# EAGLE design eNode2 (EAGLE 7.2.0)
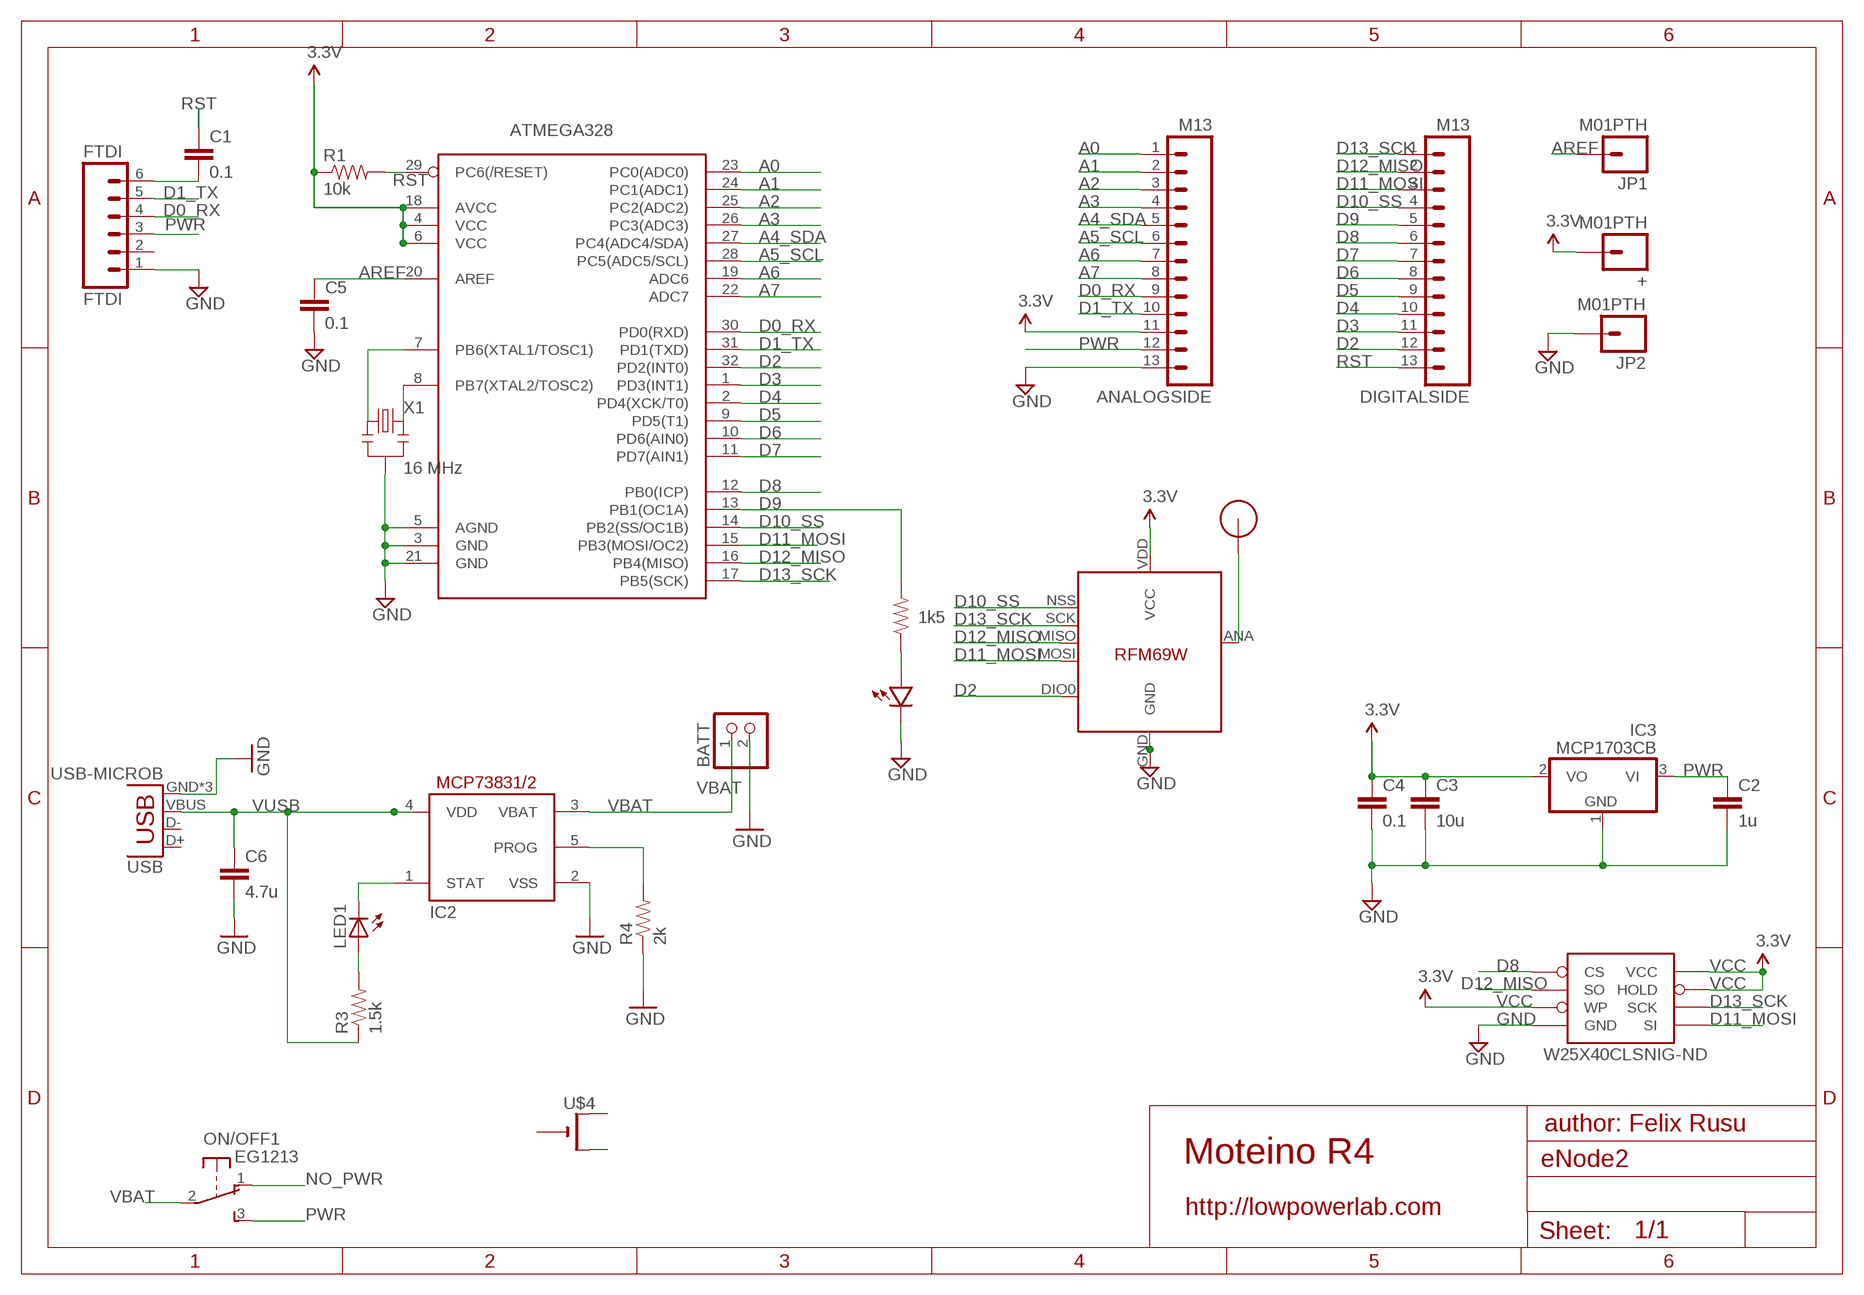
[diagram p0: schematic, sheet 1]

## Parts
+  M01PTH  [1X01]
ANALOGSIDE  M13  [1X13]
ATMEGA328  ATMega-328  ATMEGA168/328TQFP32  [TQFP32-08]
BATT  PINHD-1X2  [1X02]
C1  0.1  CAP0603-CAP  [0603-CAP]
C2  1u  CAP0603-CAP  [0603-CAP]
C3  10u  CAP0805-CAP  [0805-CAP]
C4  0.1  CAP0603-CAP  [0603-CAP]
C5  0.1  CAP0603-CAP  [0603-CAP]
C6  4.7u  CAP0603-CAP  [0603-CAP]
DIGITALSIDE  M13  [1X13]
FTDI  FTDI  M06SIP  [1X06]
IC2  MCP73831/OT  [SOT23-5L]
IC3  MCP1703CB  [SOT23]
JP1  M01PTH  [1X01]
JP2  M01PTH  [1X01]
LED1  LEDCHIPLED_0603  [CHIPLED_0603]
ON/OFF  EG1213  [EG1213]
R1  10k  RESISTOR0603-RES  [0603-RES]
R2  1k5  RESISTOR0603-RES  [0603-RES]
R3  1.5k  RESISTOR0603-RES  [0603-RES]
R4  2k  RESISTOR0603-RES  [0603-RES]
U$1  RFM12B_ANTENNA  [RFM12B-ANTENNA]
U$2  LED0603  [0603-LED]
U$4  CR2032THM  [CR2032-THRU]
U$5  RFM69  [RFM69W-MINPADS]
USB  USB-MICROB  [USB-MICROB]
W25X40CLSNIG-ND  AT25F512BWIDE_5.3MM  [SO08WIDE]
X1  16 MHz  RESONATORSMD  [RESONATOR-SMD]

## Nets
A0: ANALOGSIDE.1 ATMEGA328.23(PC0(ADC0))
A1: ANALOGSIDE.2 ATMEGA328.24(PC1(ADC1))
A2: ANALOGSIDE.3 ATMEGA328.25(PC2(ADC2))
A3: ANALOGSIDE.4 ATMEGA328.26(PC3(ADC3))
A4_SDA: ANALOGSIDE.5 ATMEGA328.27(PC4(ADC4/SDA))
A5_SCL: ANALOGSIDE.6 ATMEGA328.28(PC5(ADC5/SCL))
A6: ANALOGSIDE.7 ATMEGA328.19(ADC6)
A7: ANALOGSIDE.8 ATMEGA328.22(ADC7)
AREF: ATMEGA328.20(AREF) C5.1 JP1.1
D0_RX: ANALOGSIDE.9 ATMEGA328.30(PD0(RXD)) FTDI.4
D1_TX: ANALOGSIDE.10 ATMEGA328.31(PD1(TXD)) FTDI.5
D2: ATMEGA328.32(PD2(INT0)) DIGITALSIDE.12 U$5.DIO0
D3: ATMEGA328.1(PD3(INT1)) DIGITALSIDE.11
D4: ATMEGA328.2(PD4(XCK/T0)) DIGITALSIDE.10
D5: ATMEGA328.9(PD5(T1)) DIGITALSIDE.9
D6: ATMEGA328.10(PD6(AIN0)) DIGITALSIDE.8
D7: ATMEGA328.11(PD7(AIN1)) DIGITALSIDE.7
D8: ATMEGA328.12(PB0(ICP)) DIGITALSIDE.6 W25X40CLSNIG-ND.1(CS)
D9: ATMEGA328.13(PB1(OC1A)) DIGITALSIDE.5 R2.2
D10_SS: ATMEGA328.14(PB2(SS/OC1B)) DIGITALSIDE.4 U$5.NSS(SEL)
D11_MOSI: ATMEGA328.15(PB3(MOSI/OC2)) DIGITALSIDE.3 U$5.MOSI W25X40CLSNIG-ND.5(SI)
D12_MISO: ATMEGA328.16(PB4(MISO)) DIGITALSIDE.2 U$5.MISO W25X40CLSNIG-ND.2(SO)
D13_SCK: ATMEGA328.17(PB5(SCK)) DIGITALSIDE.1 U$5.SCK W25X40CLSNIG-ND.6(SCK)
GND [power]: ANALOGSIDE.13 ATMEGA328.3(GND) ATMEGA328.5(AGND) ATMEGA328.21(GND) BATT.2 C2.2 C3.2 C4.2 C5.2 C6.2 FTDI.1 IC2.2(VSS) IC3.1(GND) JP2.1 R4.1 U$2.MINUS U$5.GND USB.GND USB.MT1(GND) USB.MT2(GND) W25X40CLSNIG-ND.4(GND) X1.2
N$1: ATMEGA328.7(PB6(XTAL1/TOSC1)) X1.1
N$2: R2.1 U$2.PLUS
N$3: U$1.P$1 U$5.ANA(ANT)
N$4: LED1.A R3.2
N$20: C1.2 FTDI.6
N$21: ATMEGA328.8(PB7(XTAL2/TOSC2)) X1.3
NO_PWR: ON/OFF.1(1:O)
PROG: IC2.5(PROG) R4.2
PWR [power]: ANALOGSIDE.12 C2.1 FTDI.3 IC3.3(VI) ON/OFF.3(1:S)
RST: ATMEGA328.29(PC6(/RESET)) C1.1 DIGITALSIDE.13 R1.2
STAT: IC2.1(STAT) LED1.C
VBAT: BATT.1 IC2.3(VBAT) ON/OFF.2(1:P)
VCC: +.1 ANALOGSIDE.11 ATMEGA328.4(VCC) ATMEGA328.6(VCC) ATMEGA328.18(AVCC) C3.1 C4.1 IC3.2(VO) R1.1 U$5.VDD(VCC) W25X40CLSNIG-ND.3(WP) W25X40CLSNIG-ND.7(HOLD) W25X40CLSNIG-ND.8(VCC) ; supply symbol labelled 3.3V
VUSB: C6.1 IC2.4(VDD) R3.1 USB.VBUS
Unconnected: FTDI.2 ON/OFF.MT1(MT) ON/OFF.MT2(MT) U$4.+1(+) U$4.+2(+1) U$4.- USB.D+ USB.D-

## Notes on the sheet
- author: Felix Rusu
- Moteino R4
- http://lowpowerlab.com

## Library data of the parts
+ JP1 JP2 = SparkFun-Connectors:M01: Header 1 Standard 1-pin 0.1" header. Use with straight break away headers (SKU : PRT-00116), right angle break away headers (PRT-00553), swiss pins (PRT-00743), machine pins (PRT-00117), and female headers (PRT-00115).
ANALOGSIDE DIGITALSIDE = SparkFun-Connectors:M13: 13-pin single row .1" header
ATMEGA328 = LowPowerLab:ATMEGA168/328: Atmel 32-pin 8-bit micro, 16k flash.
BATT = pinhead:PINHD-1X2: PIN HEADER
C1-C5 = LowPowerLab:CAP: Capacitor Standard 0603 ceramic capacitor, and 0.1" leaded capacitor.
C6 = SparkFun-Passives:CAP: Capacitor Standard 0603 ceramic capacitor, and 0.1" leaded capacitor.
FTDI = SparkFun-Connectors:M06: Header 6 Standard 6-pin 0.1" header. Use with straight break away headers (SKU : PRT-00116), right angle break away headers (PRT-00553), swiss pins (PRT-00743), machine pins (PRT-00117), and female headers (PRT-00115). Molex polarized connector foot print use with SKU : PRT-08094 with associated crimp pins and housings. NOTES ON THE VARIANTS LOCK and LOCK_LONGPADS... This footprint was designed to help hold the alignment of a through-hole component (i.e. 6-pin header) while soldering it into place. You may notice that each hole has been shifted either up or down by 0.005 of an inch from it's more standard position (which is a perfectly straight line). This slight alteration caused the pins (the squares in the middle) to touch the edges of the holes. Because they are alternating, it causes a "brace" to hold the component in place. 0.005 has proven to be the perfect amount of "off-center" position when using our standard breakaway headers. Although looks a little odd when you look at the bare footprint, once you have a header in there, the alteration is very hard to notice. Also, if you push a header all the way into place, it is covered up entirely on the bottom side. This idea of altering the position of holes to aid alignment will be further integrated into the Sparkfun Library for other footprints. It can help hold any component with 3 or more connection pins.
IC2 = adafruit:MCP73831: MCP73831/2 Miniature Single-Cell, Fully Integrated Li-Ion, Li-Polymer Charge Management Controllers. Nice and small simple lipoly charge controller, with adjustable current and status output (LED) http://www.ladyada.net/library/pcb/eaglelibrary.html
IC3 = linear:MCP1703: 250 mA, 16V, Low Quiescent Current LDO Regulator Source: http://ww1.microchip.com/downloads/en/DeviceDoc/22049b.pdf
LED1 = adafruit:LED: LED OSRAM: - CHIPLED LG R971, LG N971, LY N971, LG Q971, LY Q971, LO R971, LY R971 LH N974, LH R974 LS Q976, LO Q976, LY Q976 LO Q996 - Hyper CHIPLED LW Q18S LB Q993, LB Q99A, LB R99A - SideLED LS A670, LO A670, LY A670, LG A670, LP A670 LB A673, LV A673, LT A673, LW A673 LH A674 LY A675 LS A676, LA A676, LO A676, LY A676, LW A676 LS A679, LY A679, LG A679 - Hyper Micro SIDELED® LS Y876, LA Y876, LO Y876, LY Y876 LT Y87S - SmartLED LW L88C, LW L88S LB L89C, LB L89S, LG L890 LS L89K, LO L89K, LY L89K LS L896, LA L896, LO L896, LY L896 - TOPLED LS T670, LO T670, LY T670, LG T670, LP T670 LSG T670, LSP T670, LSY T670, LOP T670, LYG T670 LG T671, LOG T671, LSG T671 LB T673, LV T673, LT T673, LW T673 LH T674 LS T676, LA T676, LO T676, LY T676, LB T676, LH T676, LSB T676, LW T676 LB T67C, LV T67C, LT T67C, LS T67K, LO T67K, LY T67K, LW E67C LS E67B, LA E67B, LO E67B, LY E67B, LB E67C, LV E67C, LT E67C LW T67C LS T679, LY T679, LG T679 LS T770, LO T770, LY T770, LG T770, LP T770 LB T773, LV T773, LT T773, LW T773 LH T774 LS E675, LA E675, LY E675, LS T675 LS T776, LA T776, LO T776, LY T776, LB T776 LHGB T686 LT T68C, LB T68C - Hyper Mini TOPLED® LB M676 - Mini TOPLED Santana® LG M470 LS M47K, LO M47K, LY M47K Source: http://www.osram.convergy.de/
ON/OFF = adafruit:EG1213: E-Switch right-angle slide SPDT Part #EG1213 http://www.ladyada.net/library/eagle
R1 R2 = LowPowerLab:RESISTOR: Resistor Basic schematic elements and footprints for 0603, 1206, and PTH resistors.
R3 R4 = SparkFun-Passives:RESISTOR: Resistor Basic schematic elements and footprints for 0603, 1206, and PTH resistors.
U$1 = LowPowerLab:RFM12B_ANTENNA
U$2 = LowPowerLab:LED
U$4 = adafruit:CR2032
U$5 = LowPowerLab:RFM69
USB = SparkFun-Connectors:USB: USB Connectors USB-B-PTH is fully proven SKU : PRT-00139/CONN-08278 USB-miniB is fully proven SKU : PRT-00587 USB-A-PCB is untested. USB-A-H is throughly reviewed, but untested. Spark Fun Electronics SKU : PRT-00437 USB-B-SMT is throughly reviewed, but untested. Needs silkscreen touching up. USB-A-S has not been used/tested USB-MB-H has not been used/tested USB-MICROB has been used. CONN-09505; PROD_ID: CONN-09505
W25X40CLSNIG-ND = LowPowerLab:AT25F512B: 4-Mbit SPI flash memory
X1 = SparkFun:RESONATOR: Resonator Small SMD resonator. This is the itty bitty 10/20MHz resonators with built in caps. CSTCE10M0G55 and CSTCE20M0V53. Footprint has been reviewed closely but hasn't been tested yet.

## Net classes
1 power: width 0.381 mm, clearance 0.254 mm

## Board
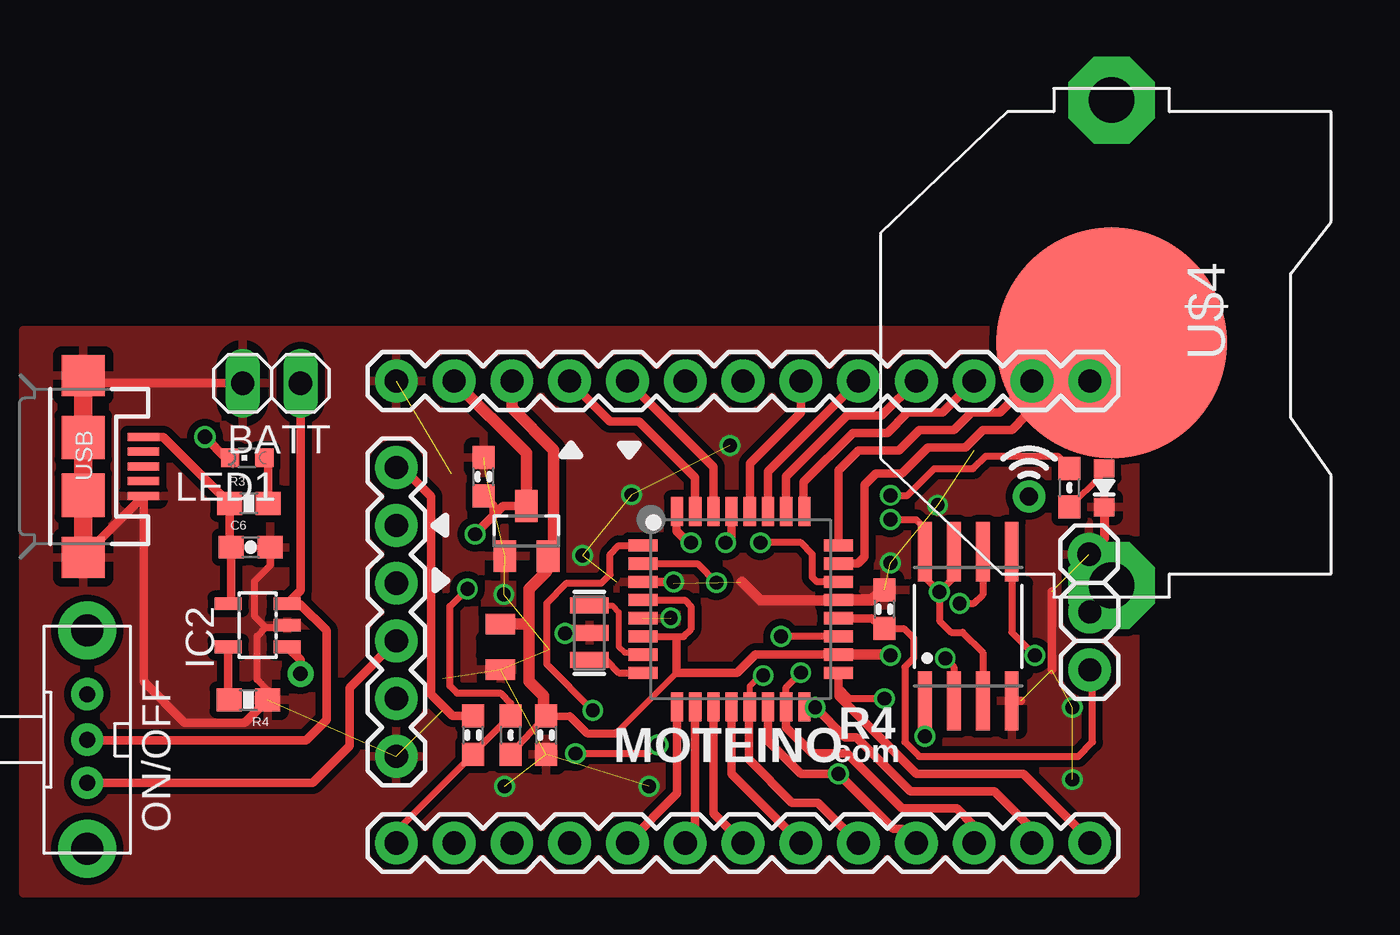
[diagram p1: board, top side]
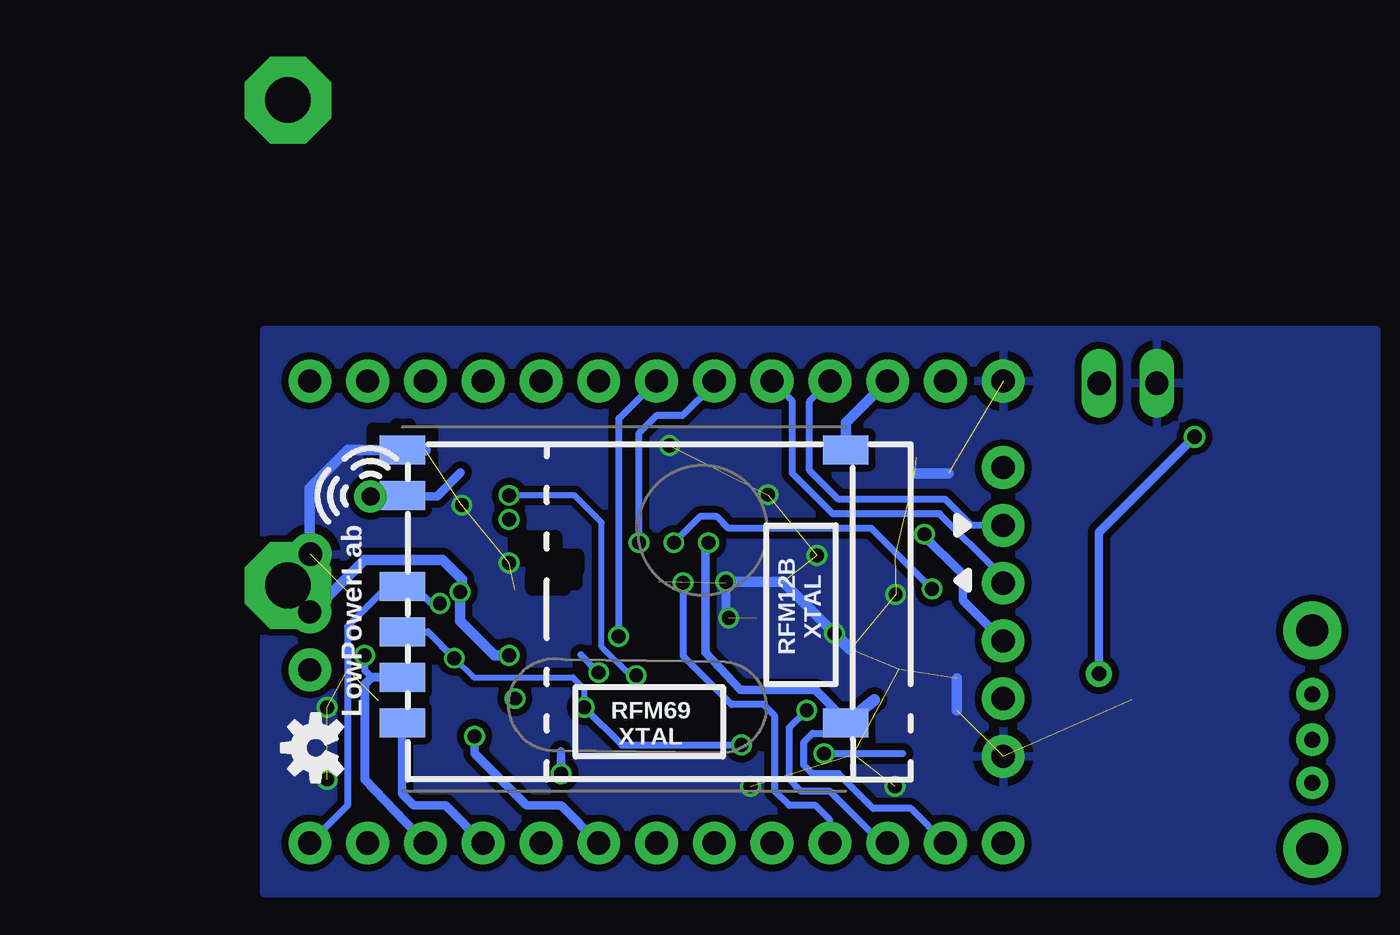
[diagram p2: board, bottom side, seen from below]

No outline drawn. Coordinates in mm, seen from the top.
Copper layers (1*16): Top 0.035mm / dielectric 1.5mm / Bottom 0.035mm
Design rules "ITEADstudio_DRC *": minimum track width 10mil, minimum drill 12mil, track to track 10mil, track to pad 10mil, pad to pad 10mil, via to via 10mil, smd to smd 0mil, copper to edge 10mil, drill to drill 10mil, minimum pad ring 10mil, minimum via ring 6mil, stop-mask expansion 2mil, vias tented up to drill 100mil, thermal gap 15mil
tRestrict: area 38.6,8.9 to 43.5,12.9; area 20.2,16.9 to 21.2,18.6; area 19.6,9.7 to 21.1,10.5
bRestrict: area 41.8,17.7 to 43.6,18.7; area 35.5,13.9 to 37.2,14.9; area 36,12.6 to 36.5,13.3; area 35.1,12.6 to 35.6,13.3; area 34.6,12.9 to 35.1,13.5; area 34.5,13.5 to 35,14.1; area 40.9,18.9 to 41.4,19.6; area 40.9,17.9 to 41.4,18.5; area 41.9,19.2 to 42.4,19.8; area 42.3,18.9 to 43.5,19.6

### Footprints (pad centres in the part's own frame; a part is rotated, then mirrored left to right if it is on the bottom)
1X01 = drill 1.016 pad 1.88: 1 0,0
1X13 = drill 1.016 pad 1.88: 1 0,0; 2 2.54,0; 3 5.08,0; 4 7.62,0; 5 10.16,0; 6 12.7,0; 7 15.24,0; 8 17.78,0; 9 20.32,0; 10 22.86,0; 11 25.4,0; 12 27.94,0; 13 30.48,0
TQFP32-08 = smd 1.27 x 0.533: 1 -4.293,2.8; 2 -4.293,2; 3 -4.293,1.2; 4 -4.293,0.4; 5 -4.293,-0.4; 6 -4.293,-1.2; 7 -4.293,-2; 8 -4.293,-2.8; 17 4.293,-2.8; 18 4.293,-2; 19 4.293,-1.2; 20 4.293,-0.4; 21 4.293,0.4; 22 4.293,1.2; 23 4.293,2; 24 4.293,2.8 | smd 0.533 x 1.27: 9 -2.8,-4.293; 10 -2,-4.293; 11 -1.2,-4.293; 12 -0.4,-4.293; 13 0.4,-4.293; 14 1.2,-4.293; 15 2,-4.293; 16 2.8,-4.293; 25 2.8,4.293; 26 2,4.293; 27 1.2,4.293; 28 0.4,4.293; 29 -0.4,4.293; 30 -1.2,4.293; 31 -2,4.293; 32 -2.8,4.293
1X02 = drill 1.016 long: 1 -1.27,0; 2 1.27,0
0603-CAP = smd 1.016 x 0.965: 1 -0.85,0; 2 0.85,0
0805-CAP = smd 0.902 x 1.3: 1 -1,0; 2 1,0
0603-CAP' = smd 1.1 x 1: 1 -0.85,0; 2 0.85,0
1X06 = drill 1.016 pad 1.88: 1 0,0; 2 2.54,0; 3 5.08,0; 4 7.62,0; 5 10.16,0; 6 12.7,0
SOT23-5L = smd 0.55 x 1.2: 1 -0.95,-1.3; 2 0,-1.3; 3 0.95,-1.3; 4 0.95,1.3; 5 -0.95,1.3
SOT23 = smd 1 x 1.4: 1 -0.95,-1.1; 2 0.95,-1.1; 3 0,1.1
CHIPLED_0603 = smd 0.8 x 0.8: A 0,-0.75; C 0,0.75
EG1213 = drill 0.7 pad 1.422: 1 -2,0; 2 0,0; 3 1.9,0 | drill 1.4 pad 2.54: MT1 -4.8,0; MT2 4.8,0
0603-RES = smd 1.016 x 0.965: 1 -0.85,0; 2 0.85,0
0603-RES' = smd 1.1 x 1: 1 -0.85,0; 2 0.85,0
RFM12B-ANTENNA = drill 0.8 pad 1.422: P$1 0,0
0603-LED = smd 0.8 x 0.9: MINUS -0.85,0; PLUS 0.85,0
CR2032-THRU = drill 2 pad 3.81 octagon: +1 -10.668,0; +2 10.668,0 | smd 10.16 x 10.16: - 0,0
RFM69W-MINPADS = smd 2 x 1.27: ANA 8,-5; DIO0 -11.5,5; GND 8,-7; MISO 8,1; MOSI 8,3; NSS 8,5; SCK 8,-1; VDD -11.5,-7
USB-MICROB = smd 0.35 x 1.4: D+ 0,2.65; D- -0.65,2.65; GND 1.3,2.65; ID 0.65,2.65; VBUS -1.3,2.65 | smd 1.8 x 1.9: MT1 -4,0; MT2 4,0 | smd 1.9 x 1.9: P$1 -1.27,0; P$2 1.27,0
SO08WIDE = smd 0.61 x 2.6: 1 -1.905,-3.269; 2 -0.635,-3.269; 3 0.635,-3.269; 4 1.905,-3.269; 5 1.905,3.286; 6 0.635,3.286; 7 -0.635,3.286; 8 -1.905,3.286
RESONATOR-SMD = smd 0.7 x 1.7: 1 -1.2,0; 2 0,0; 3 1.2,0

### Placement (x,y rotation side)
+  46.25,11.61 270 top
ANALOGSIDE  46.25,21.77 180 top
ATMEGA328  30.91,11.73 0 top
BATT  10.29,21.67 180 top
C1  19.15,6.2 90 top
C2  19.61,17.55 90 top
C3  20.35,10.08 270 top
C4  22.35,6.2 270 top
C5  37.24,11.73 90 top
C6  4.7u  [0603-CAP']  9.37,14.45 0 top
DIGITALSIDE  46.25,1.45 180 top
FTDI  15.77,5.26 90 top
IC2  9.68,11.02 90 top
IC3  21.49,15.16 0 top
JP1  46.25,9.07 0 top
JP2  46.23,14.15 0 top
LED1  9.22,18.39 90 top
ON/OFF  2.18,5.99 270 top
R1  20.8,6.2 90 top
R2  45.36,17.07 90 top
R3  1.5k  [0603-RES']  9.3,16.38 0 top
R4  2k  [0603-RES']  9.27,7.75 180 top
U$1  43.59,16.69 0 top
U$2  46.89,17.07 90 top
U$3  [OSHW-LOGO-S]  46,5.64 90 bottom
U$4  47.22,23.44 270 top
U$5  34.19,11.73 180 bottom
USB  2.01,18.01 270 top
W25X40CLSNIG-ND  40.92,10.97 0 top
X1  24.26,10.69 270 top

### Tracks (layer width: path | path; a pad name or v marks a point on that pad's centre or on a via)
A0
  Top 0.381: ATMEGA328.23 36.06,13.73 36.35,14.02 36.35,17.2 36.85,17.7 38,17.7 39.14,18.85 40.79,18.85 41.55,19.61 42.82,19.61 43.46,20.24 44.73,20.24 ANALOGSIDE.1
A1
  Top 0.381: ATMEGA328.24 35.2,17.83 36.09,18.72 37.87,18.72 38.76,19.61 40.28,19.61 41.05,20.37 42.32,20.37 ANALOGSIDE.2
A2
  Top 0.381: ATMEGA328.25 33.68,16.03 33.68,17.32 35.84,19.48 37.36,19.48 38.25,20.37 39.78,20.37 ANALOGSIDE.3
A3
  Top 0.381: ATMEGA328.26 32.91,17.57 35.59,20.24 37.11,20.24 ANALOGSIDE.4
A4_SDA
  Top 0.381: ATMEGA328.27 32.11,17.79 ANALOGSIDE.5
A5_SCL
  Top 0.381: ATMEGA328.28 31.31,18.13 33.55,20.37 ANALOGSIDE.6
A6  (via drill 0.61)
  Top 0.305: ATMEGA328.19 v32.69,10.54
  Bottom 0.305: 32.66,10.46 32.66,20.12 ANALOGSIDE.7
  Bottom 0.381: 32.66,10.46 v32.69,10.54
A7  (via drill 0.61)
  Top 0.305: ATMEGA328.22 34.26,12.94 34.06,13.13 34.06,14.15 33.55,14.66 v31.77,14.66
  Bottom 0.305: v31.77,14.66 31.77,19.48 31.01,20.24 29.87,20.24 28.47,21.64 ANALOGSIDE.8
AREF
  Top 0.305: C5.1 38.09,10.88 38.51,10.46 38.51,9.58 38.12,9.2 38.12,5.89 38.76,5.26 45.74,5.26 46.38,5.89 46.38,8.94 JP1.1
  Top 0.381: ATMEGA328.20 36.66,11.34 C5.1
D0_RX
  Top 0.381: ATMEGA328.30 29.71,17.99 ANALOGSIDE.9
  Bottom 0.305: 16.03,12.88 16.03,13.39 18.57,15.93 23.27,15.93 25.04,17.7 25.04,20.88 ANALOGSIDE.9
  Bottom 0.381: 16.03,12.88 FTDI.4
D1_TX
  Top 0.381: ATMEGA328.31 28.91,17.52 26.44,19.99 25.17,19.99 ANALOGSIDE.10
  Bottom 0.305: FTDI.5 17.17,15.42 18.31,16.56 23.01,16.56 24.28,17.83 24.28,20.88 ANALOGSIDE.10
D2  (via drill 0.61)
  Top 0.381: v28.73,14.66 28.6,14.66 28.09,15.16 28.09,15.88 ATMEGA328.32
  Bottom 0.305: DIGITALSIDE.12 19.84,2.97 21.49,2.97 23.01,4.5 24.16,4.5 24.54,4.88 24.54,5.89 24.16,6.27 23.15,6.27 U$5.DIO0
  Bottom 0.381: 22.23,6.94 22.79,6.94 24.03,8.18 27.33,8.18 28.85,9.83 28.85,14.4 v28.73,14.66
  Bottom 0.406: U$5.DIO0 22.43,6.74 22.23,6.94
  Bottom 0.508: 21.43,7.74 U$5.DIO0
D3  (via drill 0.61)
  Top 0.305: v24.41,7.29 22.38,9.32 22.38,11.99 23.27,12.88 24.79,12.88 25.17,13.26 25.17,14.15 25.55,14.53 ATMEGA328.1
  Top 0.381: ATMEGA328.1
  Bottom 0.305: DIGITALSIDE.11 21.11,1.45 23.39,3.73 24.66,3.73 25.17,4.24 25.17,6.53 v24.41,7.29
D4  (via drill 0.61)
  Top 0.305: ATMEGA328.2 29,13.73 v29.84,12.9
  Top 0.381: 26.54,13.79 ATMEGA328.2
  Bottom 0.305: DIGITALSIDE.10 23.39,2.46 24.03,3.1 25.17,3.1 25.81,3.73 25.81,7.04 26.31,7.54 27.71,7.54 29.84,9.67 v29.84,12.9
D5
  Top 0.381: ATMEGA328.9 28.11,3.63 DIGITALSIDE.9
D6
  Top 0.381: DIGITALSIDE.8 28.91,1.89 ATMEGA328.10
D7
  Top 0.381: ATMEGA328.11 29.71,2.75 DIGITALSIDE.7
D8  (via drill 0.61)
  Top 0.305: v39.01,6.15 39,7.8 W25X40CLSNIG-ND.1
  Top 0.381: ATMEGA328.12 30.51,4.49 DIGITALSIDE.6
  Bottom 0.381: v39.01,6.15 39.01,5.38 36.73,3.1 35.2,3.1 DIGITALSIDE.6
D9  (via drill 0.61)
  Top 0.254: ATMEGA328.13 31.31,8.35 31.77,8.81 v31.9,8.81
  Top 0.305: R2.2 45.15,18.17 44.85,18.47 41.68,18.47 41.12,17.91 39.42,17.91 38.25,16.74 v37.49,16.74
  Top 0.381: ATMEGA328.13 31.27,7.36 31.27,5.13 33.17,3.23 34.31,3.23 DIGITALSIDE.5
  Bottom 0.254: v31.9,8.81 32.16,8.81 33.43,10.08 33.43,15.54 34.62,16.74 v37.49,16.74
D10_SS  (via drill 0.61)
  Top 0.381: ATMEGA328.14 32.11,5.94 33.55,4.5 v35.2,4.5 37.62,2.08 38,2.08 DIGITALSIDE.4
  Bottom 0.381: v35.2,4.5 35.2,5.48 | U$5.NSS 42.19,3.61 41.68,3.1 40.28,3.1 DIGITALSIDE.4
D11_MOSI  (via drill 0.61)
  Top 0.305: v43.84,9.7 42.82,10.72 W25X40CLSNIG-ND.5 | ATMEGA328.15 32.91,8.3 v33.55,8.94
  Top 0.381: ATMEGA328.15 32.91,6.53 34.06,5.38 35.59,5.38 38,2.97 40.41,2.97 41.17,2.21 DIGITALSIDE.3
  Bottom 0.305: v43.84,9.7 43.84,9.04 43.54,8.73 | v33.55,8.94 34.35,9.73
  Bottom 0.381: DIGITALSIDE.3 43.84,4.24
  Bottom 0.406: U$5.MOSI 43.54,8.73 43.84,8.43 43.84,4.24
D12_MISO  (via drill 0.61)
  Top 0.305: v39.9,9.58 40.28,9.2 W25X40CLSNIG-ND.2 | v23.65,5.38 26.77,5.38 v27.28,5.77
  Top 0.381: ATMEGA328.16 34.29,7.44 v34.19,7.42 35.5,6.11 36.01,6.11 38.38,3.73 42.06,3.73 43.71,2.08 DIGITALSIDE.2
  Bottom 0.254: v39.9,9.58 39.06,8.74 34.7,8.74 34.19,8.23 v34.19,7.42
  Bottom 0.305: U$5.MISO 41.06,10.73 v39.9,9.58 40.22,9.89 | v34.19,7.42 32.54,5.77 v27.28,5.77 | v23.65,5.38 20.19,5.38
D13_SCK  (via drill 0.61)
  Top 0.305: v40.54,11.99 41.17,11.99 41.55,12.37 W25X40CLSNIG-ND.6 | v37.24,7.8 35.71,7.8 35.2,8.31
  Top 0.381: DIGITALSIDE.1 46.25,1.57 43.33,4.5 38.63,4.5 35.2,7.92 35.2,8.31 ATMEGA328.17
  Bottom 0.305: 37.17,7.74 v37.24,7.8 | DIGITALSIDE.1 44.6,3.1 44.6,10.97 42.84,12.73 U$5.SCK 42.17,12.75 41.68,12.75 40.92,11.99 v40.54,11.99
GND  (via drill 0.61)  (24 unrouted)
  Top 0.305: C6.2 10.22,13.65 9.53,12.95 9.53,11.43 10.03,10.92 | 10.03,10.92 10.88,10.92 IC2.2 | R4.1 10.12,8.17 9.65,8.64 9.65,10.54 10.03,10.92
  Top 0.381: 35.31,12.12 ATMEGA328.21 | v27.96,12.93 ATMEGA328.3 | 30.91,12.93 30.96,12.93 | W25X40CLSNIG-ND.4 43.24,7.7 | 44.6,9.07 44.6,12.52 | v23.2,10.67 X1.2 | 1.23,14.01 USB.MT2 2.01,14.06 USB.GND 4.66,8.55 6.48,6.73 9.11,6.73 R4.1 | BATT.2 2.35,21.67 USB.MT1
  Top 0.406: U$2.MINUS 46.89,14.81 JP2.1
  Top 0.457: 35.31,12.12 31.77,12.12 30.96,12.93
  Top 0.508: ATMEGA328.21 36.66,12.13 C5.2 37.36,12.46
  Top 0.813: USB.MT2 USB.MT1
  Bottom 0.381: 27.96,12.86 v27.96,12.93 27.96,11.35 v27.84,11.35
  Bottom 0.457: 41.19,18.73 44.59,18.73 46.25,17.07 46.25,14.17 JP2.1 | v23.2,10.67 25.46,12.93 v27.96,12.93 | 17.8,8.69 17.8,7.29 | 18.19,17.7 19.68,17.7
  Bottom 0.508: U$5.GND 41.19,18.73 | 22.49,9.96 v23.2,10.67
  other vias: 20.5,12.38 37.49,13.77 20.53,3.94 26.88,3.94 23.96,14.1 26.12,16.76 30.44,18.92 39.57,16.31 45.49,7.42 45.49,4.24
  pour Bottom (isolate 0.305): -0.64,24 -0.64,-0.76 48.26,-0.76 48.26,24
  pour Top (isolate 0.305): -0.64,24 -0.64,-0.76 48.26,-0.76 48.26,24
N$1
  Top 0.254: X1.1 25.27,11.89 25.55,11.61 25.55,10.08 25.81,9.83 26.52,9.83 ATMEGA328.7
N$2
  Top 0.254: R2.1 46.76,17.62 U$2.PLUS
N$3
  Bottom 0.381: U$1.P$1 42.87,16.73 U$5.ANA 41.89,16.69 40.66,16.69 39.62,17.73
N$4
  Top 0.381: R3.2 10.15,18.21 LED1.A
N$20
  Top 0.381: C1.2 18.24,7.05 17.3,7.99 17.3,16.69 16.03,17.96 FTDI.6
N$21
  Top 0.305: X1.3 25,9.49 25.55,8.94 26.61,8.94 ATMEGA328.8
PROG
  Top 0.381: IC2.5 8.38,7.79 R4.2
PWR  (via drill 0.61 pad 0.81)
  Top 0.381: v19.24,15.03 20.05,15.84 | 20.05,15.84 20.47,16.26 IC3.3 | C2.1 20.05,16.26 20.05,15.84 | ON/OFF.3 12.1,4.09 13.72,5.71 13.72,8.28 FTDI.3
  Top 0.508: ANALOGSIDE.12 21.49,18.59 IC3.3
  Bottom 0.381: FTDI.3 17.55,12.12 17.55,13.26 19.36,15.07 v19.24,15.03
RST  (via drill 0.61, 0.61 pad 0.69)
  Top 0.305: DIGITALSIDE.13 15.77,1.97 C1.1 19.15,5.4 R1.2 20.8,7.59 20.34,8.05 18.44,8.05 18.14,8.36 18.14,11.86 v18.9,12.62
  Top 0.381: ATMEGA328.29 30.51,14.92 v30.25,14.66
  Bottom 0.305: v30.25,14.66 29.11,15.8 28.35,15.8 27.84,15.29 21.57,15.29 v18.9,12.62
STAT  (via drill 0.64, 0.64 pad 1.14)
  Top 0.381: LED1.C 8.28,18.39 v7.37,19.3 | v11.56,8.89 11.56,9.49 IC2.1
  Bottom 0.381: v7.37,19.3 11.56,15.11 v11.56,8.89
VBAT
  Top 0.381: ON/OFF.2 2.21,5.97 11.81,5.97 12.7,6.86 12.7,10.79 11.52,11.97 IC2.3 11.56,12.55 BATT.1
VCC  (via drill 0.61)
  Top 0.279: 25.43,6.27 28.09,8.94
  Top 0.305: ATMEGA328.4 28.45,12.13 28.73,11.86 28.73,10.85 28.4,10.54 28.22,10.54 | ATMEGA328.6 28.22,10.54 | v39.65,12.5 39.01,13.13 W25X40CLSNIG-ND.8 | v39.65,12.5 40.28,13.13 W25X40CLSNIG-ND.7 | v39.65,12.5 39.65,11.23 40.16,10.72 40.66,10.72 41.55,9.83 W25X40CLSNIG-ND.3 | v37.49,15.67 38.62,15.67 39.01,15.28 | 28.09,10.41 28.22,10.54 | R1.1 20.8,5.37 C4.1
  Top 0.356: C4.1 23.41,7.02 24.16,6.27 25.43,6.27
  Top 0.381: 39.01,15.28 W25X40CLSNIG-ND.8 | ATMEGA328.18 31.55,9.73 30.76,8.94 28.09,8.94 28.09,10.41
  Top 0.457: ATMEGA328.18 37.59,9.73 v37.49,9.7
  Top 0.508: C4.1 22.25,7.12 22.25,7.92 21.61,8.56 21.61,11.1 | 21.61,11.1 21.61,12.62 22.38,13.39 22.38,14 IC3.2 | C3.1 21.6,11.08 21.61,11.1 | IC3.2 22.61,13.89 | ANALOGSIDE.11 20.85,20.57 U$5.VDD 22.69,14.31 IC3.2
  Top 0.635: 22.61,13.79 22.61,13.89
  Bottom 0.381: 37.55,15.73 v37.49,15.67
  Bottom 0.457: +.1 46.13,11.61 43.84,13.89 40.41,13.89 39.56,13.04 39.56,12.59 v39.65,12.5 39.65,11.23 38.12,9.7 v37.49,9.7 | U$5.VDD 22.69,19.93 ANALOGSIDE.11
VUSB
  Top 0.381: IC2.4 8.52,12.12 C6.1 8.45,14.53 R3.1 5.52,19.31 USB.VBUS

### Text on the board
tPlace: R4 | MOTEINO | .com
bPlace: RFM12B / XTAL | LowPowerLab | RFM69 / XTAL
tDocu: REG
_tsilk: VIN | 3.3 | 1 | 0 | A7 | A6 | A5 | A4 | A3 | A2 | A1 | GND | DTR | A0 | TX | RX | SCL | SDA | ANT | GND | 3.3 | FLASH | ATMEGA / 328 | MEM | AR | FTDI | GND | 2 | 3 | 4 | 5 | 6 | 7 | 8 | 9 | 10 | MO | ~ | 11 | MI | 12 | SK | 13 | RST | ~ | ~ | ~ | ~ | ~
_bsilk: VIN | 3.3 | 1 | 0 | A7 | A6 | A5 | A4 | A3 | A2 | A1 | A0 | GND | DTR | ANT | VIN | GND | 2 | 3 | 4 | 5 | 6 | 7 | 8 | 9 | 10 | 11 | 12 | 13 | RST